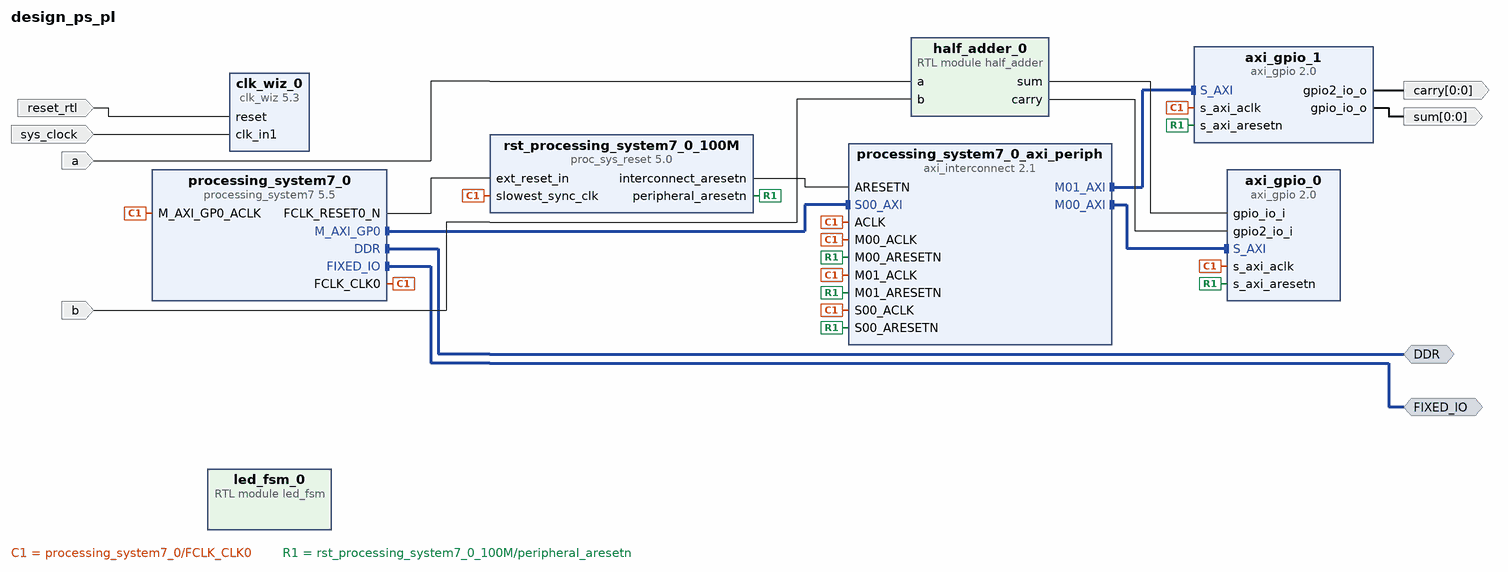
[diagram p0: block diagram of the top level]
# Vivado block design design_ps_pl, Vivado 2016.2
create_bd_design design_ps_pl

create_bd_intf_port -mode Master -vlnv xilinx.com:interface:ddrx_rtl:1.0 DDR
create_bd_intf_port -mode Master -vlnv xilinx.com:display_processing_system7:fixedio_rtl:1.0 FIXED_IO
create_bd_port -dir I a
create_bd_port -dir I b
create_bd_port -dir O -from 0 -to 0 sum
create_bd_port -dir O -from 0 -to 0 carry
create_bd_port -dir I -type rst reset_rtl
set_property -dict {CONFIG.POLARITY ACTIVE_HIGH} [get_bd_ports reset_rtl]
create_bd_port -dir I -type clk sys_clock
set_property -dict {CONFIG.FREQ_HZ 100000000 CONFIG.PHASE 0.000} [get_bd_ports sys_clock]

create_bd_cell -type ip -vlnv xilinx.com:ip:processing_system7:5.5 processing_system7_0
set_property -dict {CONFIG.preset ZedBoard} [get_bd_cells processing_system7_0]
create_bd_cell -type module -reference half_adder half_adder_0
create_bd_cell -type ip -vlnv xilinx.com:ip:axi_gpio:2.0 axi_gpio_0
set_property -dict [list \
  CONFIG.C_GPIO_WIDTH 1 \
  CONFIG.C_GPIO2_WIDTH 1 \
  CONFIG.C_IS_DUAL 1 \
  CONFIG.C_ALL_INPUTS 1 \
  CONFIG.C_ALL_INPUTS_2 1 \
] [get_bd_cells axi_gpio_0]
create_bd_cell -type ip -vlnv xilinx.com:ip:axi_gpio:2.0 axi_gpio_1
set_property -dict [list \
  CONFIG.C_GPIO_WIDTH 1 \
  CONFIG.C_GPIO2_WIDTH 1 \
  CONFIG.C_IS_DUAL 1 \
  CONFIG.C_ALL_OUTPUTS 1 \
  CONFIG.C_ALL_OUTPUTS_2 1 \
] [get_bd_cells axi_gpio_1]
create_bd_cell -type ip -vlnv xilinx.com:ip:axi_interconnect:2.1 processing_system7_0_axi_periph
set_property -dict {CONFIG.NUM_MI 2} [get_bd_cells processing_system7_0_axi_periph]
create_bd_cell -type ip -vlnv xilinx.com:ip:proc_sys_reset:5.0 rst_processing_system7_0_100M
create_bd_cell -type ip -vlnv xilinx.com:ip:clk_wiz:5.3 clk_wiz_0
set_property -dict {CONFIG.USE_BOARD_FLOW true CONFIG.CLK_IN1_BOARD_INTERFACE sys_clock} [get_bd_cells clk_wiz_0]
create_bd_cell -type module -reference led_fsm led_fsm_0

# ---- connections ----

connect_bd_intf_net [get_bd_intf_pins processing_system7_0/M_AXI_GP0] [get_bd_intf_pins processing_system7_0_axi_periph/S00_AXI]
connect_bd_intf_net [get_bd_intf_pins processing_system7_0_axi_periph/M00_AXI] [get_bd_intf_pins axi_gpio_0/S_AXI]
connect_bd_intf_net [get_bd_intf_pins processing_system7_0_axi_periph/M01_AXI] [get_bd_intf_pins axi_gpio_1/S_AXI]
connect_bd_intf_net [get_bd_intf_ports DDR] [get_bd_intf_pins processing_system7_0/DDR]
connect_bd_intf_net [get_bd_intf_ports FIXED_IO] [get_bd_intf_pins processing_system7_0/FIXED_IO]
connect_bd_net [get_bd_pins processing_system7_0/FCLK_CLK0] \
  [get_bd_pins processing_system7_0/M_AXI_GP0_ACLK] [get_bd_pins rst_processing_system7_0_100M/slowest_sync_clk] \
  [get_bd_pins axi_gpio_0/s_axi_aclk] [get_bd_pins axi_gpio_1/s_axi_aclk] \
  [get_bd_pins processing_system7_0_axi_periph/S00_ACLK] [get_bd_pins processing_system7_0_axi_periph/ACLK] \
  [get_bd_pins processing_system7_0_axi_periph/M00_ACLK] [get_bd_pins processing_system7_0_axi_periph/M01_ACLK]
connect_bd_net [get_bd_pins processing_system7_0/FCLK_RESET0_N] [get_bd_pins rst_processing_system7_0_100M/ext_reset_in]
connect_bd_net [get_bd_pins rst_processing_system7_0_100M/peripheral_aresetn] \
  [get_bd_pins axi_gpio_0/s_axi_aresetn] [get_bd_pins axi_gpio_1/s_axi_aresetn] \
  [get_bd_pins processing_system7_0_axi_periph/S00_ARESETN] [get_bd_pins processing_system7_0_axi_periph/M00_ARESETN] \
  [get_bd_pins processing_system7_0_axi_periph/M01_ARESETN]
connect_bd_net [get_bd_pins rst_processing_system7_0_100M/interconnect_aresetn] [get_bd_pins processing_system7_0_axi_periph/ARESETN]
connect_bd_net [get_bd_pins half_adder_0/sum] [get_bd_pins axi_gpio_0/gpio_io_i]
connect_bd_net [get_bd_pins half_adder_0/carry] [get_bd_pins axi_gpio_0/gpio2_io_i]
connect_bd_net [get_bd_ports a] [get_bd_pins half_adder_0/a]
connect_bd_net [get_bd_ports b] [get_bd_pins half_adder_0/b]
connect_bd_net [get_bd_pins axi_gpio_1/gpio_io_o] [get_bd_ports sum]
connect_bd_net [get_bd_pins axi_gpio_1/gpio2_io_o] [get_bd_ports carry]
connect_bd_net [get_bd_ports reset_rtl] [get_bd_pins clk_wiz_0/reset]
connect_bd_net [get_bd_ports sys_clock] [get_bd_pins clk_wiz_0/clk_in1]

# ---- address map ----
assign_bd_address -offset 0x41200000 -range 64K -target_address_space [get_bd_addr_spaces processing_system7_0/Data] [get_bd_addr_segs axi_gpio_0/S_AXI/Reg]
assign_bd_address -offset 0x41210000 -range 64K -target_address_space [get_bd_addr_spaces processing_system7_0/Data] [get_bd_addr_segs axi_gpio_1/S_AXI/Reg]

validate_bd_design
save_bd_design
